# Altium schematic sheet MCU.SchDoc
size 594 x 420 mm; Address1: Address1; Address2: Address2; Address3: Address3; Address4: Address4; DocumentNumber: АБВГ.123456.001 Э3; SheetNumber: 2; Scale: 1:1; DocumentType: Схема электрическая принципиальная; FirstReferrence: АБВГ.123456.001; PageSetup: Record=PageOptions|CenterHorizontal=False|CenterVertical=False|PrintScale=0.95|XCorrection=0.00|YCorrection=0.00|PrintKind=1|BorderSize=5000000|LeftOffset=0|BottomOffset=0|Orientation=1|PaperLength=1000|PaperWidth=1000|Scale=100|PaperSource=15|PrintQuality=600|MediaType=1|DitherType=10|PaperKind=A4|PrintScaleMode=1
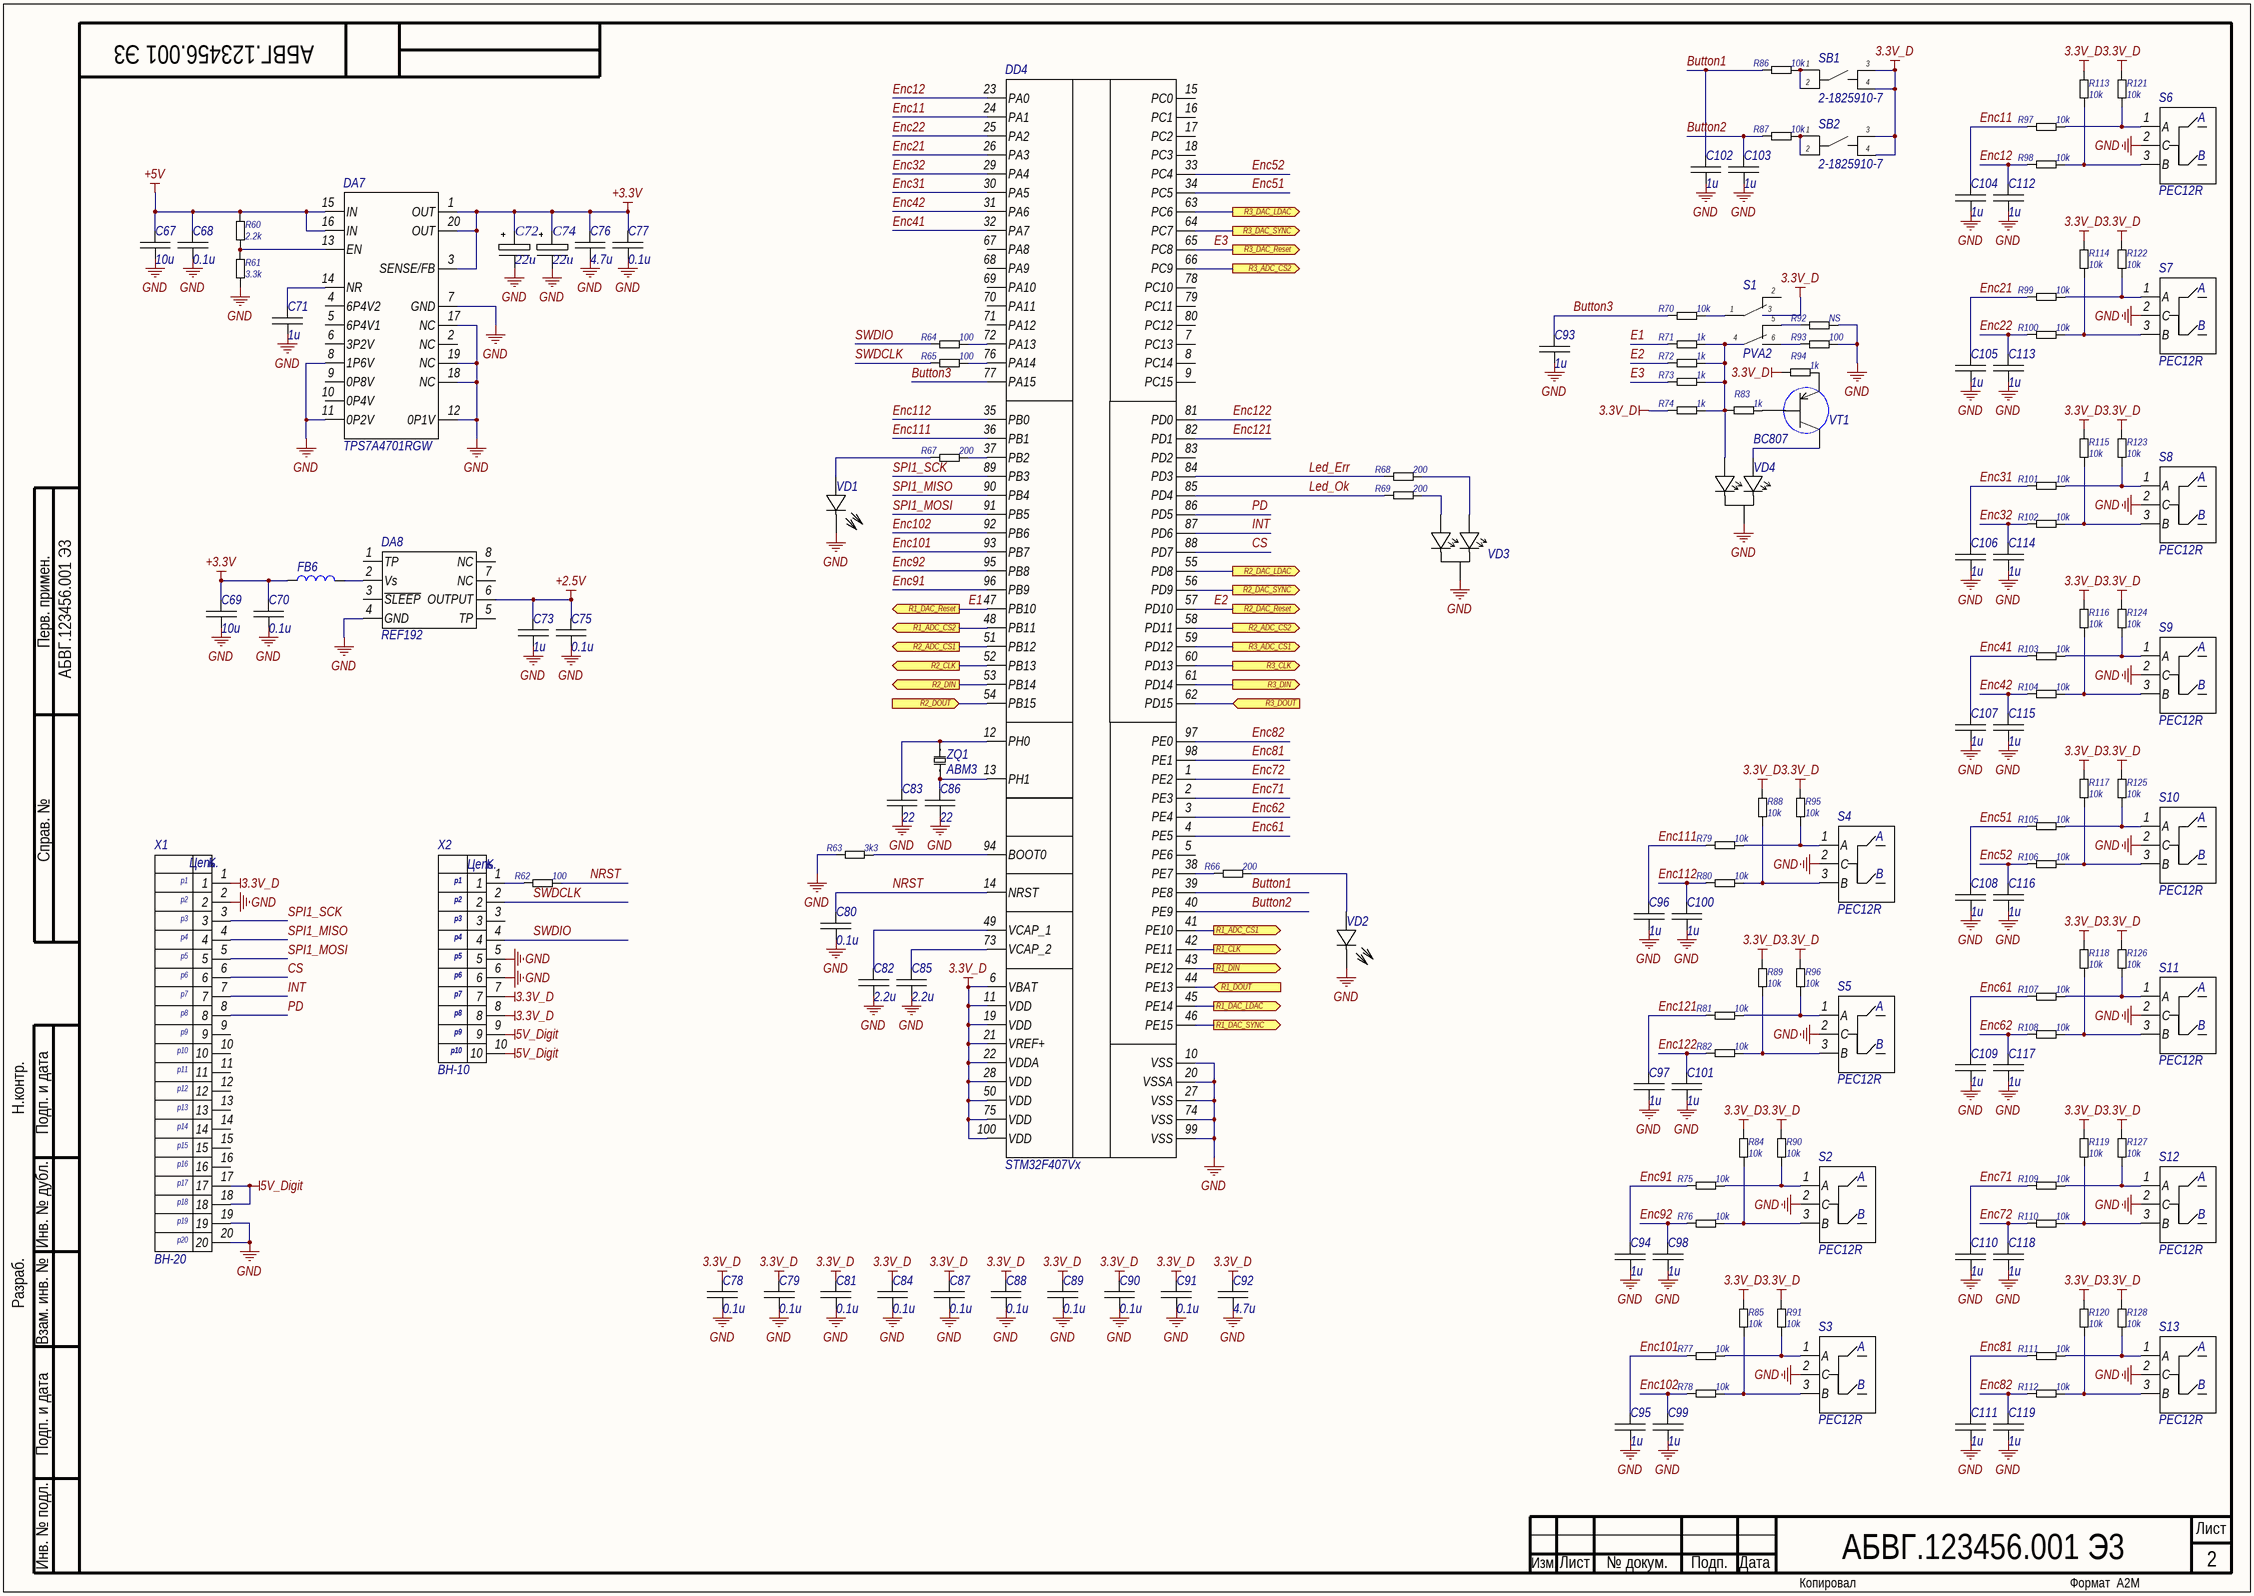
[diagram p0: MCU.SchDoc]

## Parts
C67  10u  [C1206]
C68  0.1u  [C0805]
C69  10u  [C1206]
C70  0.1u  [C0805]
C71  1u  [C0805]
C72  22u  [C0605]
C73  1u  [C0805]
C74  22u  [C0605]
C75  0.1u  [C0805]
C76  4.7u  [C0805]
C77  0.1u  [C0805]
C78  0.1u  [C0603]
C79  0.1u  [C0603]
C80  0.1u  [C0603]
C81  0.1u  [C0603]
C82  2.2u  [C0805]
C83  22  [C0603]
C84  0.1u  [C0603]
C85  2.2u  [C0805]
C86  22  [C0603]
C87  0.1u  [C0603]
C88  0.1u  [C0603]
C89  0.1u  [C0603]
C90  0.1u  [C0603]
C91  0.1u  [C0603]
C92  4.7u  [C0805]
C93  1u  [C0805]
C94  1u  [C0805]
C95  1u  [C0805]
C96  1u  [C0805]
C97  1u  [C0805]
C98  1u  [C0805]
C99  1u  [C0805]
C100  1u  [C0805]
C101  1u  [C0805]
C102  1u  [C0805]
C103  1u  [C0805]
C104  1u  [C0805]
C105  1u  [C0805]
C106  1u  [C0805]
C107  1u  [C0805]
C108  1u  [C0805]
C109  1u  [C0805]
C110  1u  [C0805]
C111  1u  [C0805]
C112  1u  [C0805]
C113  1u  [C0805]
C114  1u  [C0805]
C115  1u  [C0805]
C116  1u  [C0805]
C117  1u  [C0805]
C118  1u  [C0805]
C119  1u  [C0805]
DA7  TPS7A4701RGW  [QFN20 5x5]
DA8  REF192  [TSSOP-8_4mm]
DD4  STM32F407Vx  [LQFP100]
FB6  MH1608-601Y  [L0603]  (value not drawn)
R60  2.2k  [CR0805]
R61  3.3k  [CR0805]
R62  100  [CR0603]
R63  3k3  [CR0603]
R64  100  [CR0603]
R65  100  [CR0603]
R66  200  [CR0805]
R67  200  [CR0805]
R68  200  [CR0805]
R69  200  [CR0805]
R70  10k  [CR0805]
R71  1k  [CR0805]
R72  1k  [CR0805]
R73  1k  [CR0805]
R74  1k  [CR0805]
R75  10k  [CR0805]
R76  10k  [CR0805]
R77  10k  [CR0805]
R78  10k  [CR0805]
R79  10k  [CR0805]
R80  10k  [CR0805]
R81  10k  [CR0805]
R82  10k  [CR0805]
R83  1k  [CR0805]
R84  10k  [CR0805]
R85  10k  [CR0805]
R86  10k  [CR0805]
R87  10k  [CR0805]
R88  10k  [CR0805]
R89  10k  [CR0805]
R90  10k  [CR0805]
R91  10k  [CR0805]
R92  NS  [CR0805]
R93  100  [CR0805]
R94  1k  [CR0805]
R95  10k  [CR0805]
R96  10k  [CR0805]
R97  10k  [CR0805]
R98  10k  [CR0805]
R99  10k  [CR0805]
R100  10k  [CR0805]
R101  10k  [CR0805]
R102  10k  [CR0805]
R103  10k  [CR0805]
R104  10k  [CR0805]
R105  10k  [CR0805]
R106  10k  [CR0805]
R107  10k  [CR0805]
R108  10k  [CR0805]
R109  10k  [CR0805]
R110  10k  [CR0805]
R111  10k  [CR0805]
R112  10k  [CR0805]
R113  10k  [CR0805]
R114  10k  [CR0805]
R115  10k  [CR0805]
R116  10k  [CR0805]
R117  10k  [CR0805]
R118  10k  [CR0805]
R119  10k  [CR0805]
R120  10k  [CR0805]
R121  10k  [CR0805]
R122  10k  [CR0805]
R123  10k  [CR0805]
R124  10k  [CR0805]
R125  10k  [CR0805]
R126  10k  [CR0805]
R127  10k  [CR0805]
R128  10k  [CR0805]
S1  PVA2  [PVA2]
S2  PEC12R  [PEC12R]
S3  PEC12R  [PEC12R]
S4  PEC12R  [PEC12R]
S5  PEC12R  [PEC12R]
S6  PEC12R  [PEC12R]
S7  PEC12R  [PEC12R]
S8  PEC12R  [PEC12R]
S9  PEC12R  [PEC12R]
S10  PEC12R  [PEC12R]
S11  PEC12R  [PEC12R]
S12  PEC12R  [PEC12R]
S13  PEC12R  [PEC12R]
SB1  2-1825910-7  [Tactile_Button]
SB2  2-1825910-7  [Tactile_Button]
VD1  0805  [led 0805]  (value not drawn)
VD2  0805  [led 0805]  (value not drawn)
VD3  LED_BI  [LED_BI_5mm]  (value not drawn)
VD4  LED_BI  [LED_BI_5mm]  (value not drawn)
VT1  BC807  [SOT23]
X1  BH-20  [BH-20]
X2  BH-10  [BH-10]
ZQ1  ABM3  [ABM3]

## Ports
R1_ADC_CS1 (out), R1_ADC_CS2 (out), R1_CLK (out), R1_DAC_LDAC (out), R1_DAC_Reset (out), R1_DAC_SYNC (out), R1_DIN (out), R1_DOUT (in), R2_ADC_CS1 (out), R2_ADC_CS2 (out), R2_CLK (out), R2_DAC_LDAC (out), R2_DAC_Reset (out), R2_DAC_SYNC (out), R2_DIN (out), R2_DOUT (in), R3_ADC_CS1 (out), R3_ADC_CS2 (out), R3_CLK (out), R3_DAC_LDAC (out), R3_DAC_Reset (out), R3_DAC_SYNC (out), R3_DIN (out), R3_DOUT (in)

## Nets
3.3V_D: C78.1 C79.1 C81.1 C84.1 C87.1 C88.1 C89.1 C90.1 C91.1 C92.1 DD4.6(VBAT) DD4.11(VDD) DD4.19(VDD) DD4.21(VREF+) DD4.22(VDDA) DD4.28(VDD) DD4.50(VDD) DD4.75(VDD) DD4.100(VDD) R74.1 R84.2 R85.2 R88.2 R89.2 R90.2 R91.2 R94.1 R95.2 R96.2 R113.2 R114.2 R115.2 R116.2 R117.2 R118.2 R119.2 R120.2 R121.2 R122.2 R123.2 R124.2 R125.2 R126.2 R127.2 R128.2 S1.3 SB1.3 SB1.4 SB2.3 SB2.4 X1.1 X2.7 X2.8
5V_Digit: X1.17 X1.18 X2.9 X2.10
+2.5V: C73.1 C75.1 DA8.6(OUTPUT)
+3.3V: C69.1 C70.1 C72.1 C74.1 C76.1 C77.1 DA7.1(OUT) DA7.3(SENSE/FB) DA7.20(OUT) FB6.1
+5V: C67.1 C68.1 DA7.15(IN) DA7.16(IN) R60.2
GND: C67.2 C68.2 C69.2 C70.2 C71.2 C72.2 C73.2 C74.2 C75.2 C76.2 C77.2 C78.2 C79.2 C80.2 C81.2 C82.2 C83.2 C84.2 C85.2 C86.2 C87.2 C88.2 C89.2 C90.2 C91.2 C92.2 C93.2 C94.2 C95.2 C96.2 C97.2 C98.2 C99.2 C100.2 C101.2 C102.2 C103.2 C104.2 C105.2 C106.2 C107.2 C108.2 C109.2 C110.2 C111.2 C112.2 C113.2 C114.2 C115.2 C116.2 C117.2 C118.2 C119.2 DA7.7(GND) DA7.8(1P6V) DA7.11(0P2V) DA7.12(0P1V) DA7.17(NC) DA7.18(NC) DA7.19(NC) DA8.4(GND) DD4.10(VSS) DD4.20(VSSA) DD4.27(VSS) DD4.74(VSS) DD4.99(VSS) R61.1 R63.1 R92.2 R93.2 S2.2(C) S3.2(C) S4.2(C) S5.2(C) S6.2(C) S7.2(C) S8.2(C) S9.2(C) S10.2(C) S11.2(C) S12.2(C) S13.2(C) VD1.2 VD2.2 VD3.2 VD4.2 X1.2 X1.19 X1.20 X2.5 X2.6
Button1: C102.1 DD4.39(PE8) R86.1
Button2: C103.1 DD4.40(PE9) R87.1
Button3: C93.1 DD4.77(PA15) R70.1
CS: DD4.88(PD7) X1.6
E1: DD4.47(PB10) R71.1 ; port R1_DAC_Reset
E2: DD4.57(PD10) R72.1 ; port R2_DAC_Reset
E3: DD4.65(PC8) R73.1 ; port R3_DAC_Reset
Enc11: C104.1 DD4.24(PA1) R97.1
Enc12: C112.1 DD4.23(PA0) R98.1
Enc21: C105.1 DD4.26(PA3) R99.1
Enc22: C113.1 DD4.25(PA2) R100.1
Enc31: C106.1 DD4.30(PA5) R101.1
Enc32: C114.1 DD4.29(PA4) R102.1
Enc41: C107.1 DD4.32(PA7) R103.1
Enc42: C115.1 DD4.31(PA6) R104.1
Enc51: C108.1 DD4.34(PC5) R105.1
Enc52: C116.1 DD4.33(PC4) R106.1
Enc61: C109.1 DD4.4(PE5) R107.1
Enc62: C117.1 DD4.3(PE4) R108.1
Enc71: C110.1 DD4.2(PE3) R109.1
Enc72: C118.1 DD4.1(PE2) R110.1
Enc81: C111.1 DD4.98(PE1) R111.1
Enc82: C119.1 DD4.97(PE0) R112.1
Enc91: C94.1 DD4.96(PB9) R75.1
Enc92: C98.1 DD4.95(PB8) R76.1
Enc101: C95.1 DD4.93(PB7) R77.1
Enc102: C99.1 DD4.92(PB6) R78.1
Enc111: C96.1 DD4.36(PB1) R79.1
Enc112: C100.1 DD4.35(PB0) R80.1
Enc121: C97.1 DD4.82(PD1) R81.1
Enc122: C101.1 DD4.81(PD0) R82.1
INT: DD4.87(PD6) X1.7
Led_Err: DD4.84(PD3) R68.1
Led_Ok: DD4.85(PD4) R69.1
NRST: C80.1 DD4.14(NRST) R62.2
PD: DD4.86(PD5) X1.8
R1_ADC_CS1: DD4.41(PE10) ; port R1_ADC_CS1
R1_ADC_CS2: DD4.48(PB11) ; port R1_ADC_CS2
R1_CLK: DD4.42(PE11) ; port R1_CLK
R1_DAC_LDAC: DD4.45(PE14) ; port R1_DAC_LDAC
R1_DAC_SYNC: DD4.46(PE15) ; port R1_DAC_SYNC
R1_DIN: DD4.43(PE12) ; port R1_DIN
R1_DOUT: DD4.44(PE13) ; port R1_DOUT
R2_ADC_CS1: DD4.51(PB12) ; port R2_ADC_CS1
R2_ADC_CS2: DD4.58(PD11) ; port R2_ADC_CS2
R2_CLK: DD4.52(PB13) ; port R2_CLK
R2_DAC_LDAC: DD4.55(PD8) ; port R2_DAC_LDAC
R2_DAC_SYNC: DD4.56(PD9) ; port R2_DAC_SYNC
R2_DIN: DD4.53(PB14) ; port R2_DIN
R2_DOUT: DD4.54(PB15) ; port R2_DOUT
R3_ADC_CS1: DD4.59(PD12) ; port R3_ADC_CS1
R3_ADC_CS2: DD4.66(PC9) ; port R3_ADC_CS2
R3_CLK: DD4.60(PD13) ; port R3_CLK
R3_DAC_LDAC: DD4.63(PC6) ; port R3_DAC_LDAC
R3_DAC_SYNC: DD4.64(PC7) ; port R3_DAC_SYNC
R3_DIN: DD4.61(PD14) ; port R3_DIN
R3_DOUT: DD4.62(PD15) ; port R3_DOUT
SPI1_MISO: DD4.90(PB4) X1.4
SPI1_MOSI: DD4.91(PB5) X1.5
SPI1_SCK: DD4.89(PB3) X1.3
SWDCLK: R65.1 X2.2
SWDIO: R64.1 X2.4
NetC71_1: C71.1 DA7.14(NR)
NetC82_1: C82.1 DD4.49(VCAP_1)
NetC83_1: C83.1 DD4.12(PH0) ZQ1.2
NetC85_1: C85.1 DD4.73(VCAP_2)
NetC86_1: C86.1 DD4.13(PH1) ZQ1.1
NetDA7_13: DA7.13(EN) R60.1 R61.2
NetDA8_2: DA8.2(Vs) FB6.2
NetDD4_37: DD4.37(PB2) R67.1
NetDD4_38: DD4.38(PE7) R66.2
NetDD4_72: DD4.72(PA13) R64.2
NetDD4_76: DD4.76(PA14) R65.2
NetDD4_94: DD4.94(BOOT0) R63.2
NetR62_1: R62.1 X2.1
NetR66_1: R66.1 VD2.1
NetR67_2: R67.2 VD1.1
NetR68_2: R68.2 VD3.1
NetR69_2: R69.2 VD3.3
NetR70_2: R70.2 S1.1
NetR71_2: R71.2 R72.2 R73.2 R74.2 R83.1 S1.4 VD4.3
NetR75_2: R75.2 R90.1 S2.1(A)
NetR76_2: R76.2 R84.1 S2.3(B)
NetR77_2: R77.2 R91.1 S3.1(A)
NetR78_2: R78.2 R85.1 S3.3(B)
NetR79_2: R79.2 R95.1 S4.1(A)
NetR80_2: R80.2 R88.1 S4.3(B)
NetR81_2: R81.2 R96.1 S5.1(A)
NetR82_2: R82.2 R89.1 S5.3(B)
NetR83_2: R83.2 VT1.1
NetR86_2: R86.2 SB1.1 SB1.2
NetR87_2: R87.2 SB2.1 SB2.2
NetR92_1: R92.1 S1.5
NetR93_1: R93.1 S1.6
NetR94_2: R94.2 VT1.2
NetR97_2: R97.2 R121.1 S6.1(A)
NetR98_2: R98.2 R113.1 S6.3(B)
NetR99_2: R99.2 R122.1 S7.1(A)
NetR100_2: R100.2 R114.1 S7.3(B)
NetR101_2: R101.2 R123.1 S8.1(A)
NetR102_2: R102.2 R115.1 S8.3(B)
NetR103_2: R103.2 R124.1 S9.1(A)
NetR104_2: R104.2 R116.1 S9.3(B)
NetR105_2: R105.2 R125.1 S10.1(A)
NetR106_2: R106.2 R117.1 S10.3(B)
NetR107_2: R107.2 R126.1 S11.1(A)
NetR108_2: R108.2 R118.1 S11.3(B)
NetR109_2: R109.2 R127.1 S12.1(A)
NetR110_2: R110.2 R119.1 S12.3(B)
NetR111_2: R111.2 R128.1 S13.1(A)
NetR112_2: R112.2 R120.1 S13.3(B)
NetVD4_1: VD4.1 VT1.3

Not connected (* = marked no-connect by the designer): DA7 2(NC) 4(6P4V2) 5(6P4V1) 6(3P2V) 9(0P8V) 10(0P4V); DA8 1(TP) 3(~{SLEEP}) 5(TP) 7(NC) 8(NC); DD4 5(PE6) 7(PC13) 8(PC14) 9(PC15) 15(PC0) 16(PC1) 17(PC2) 18(PC3) 67(PA8) 68(PA9) 69(PA10) 70(PA11) 71(PA12) 78(PC10) 79(PC11) 80(PC12) 83(PD2); S1 2; X1 9 10 11 12 13 14 15 16; X2 3

## Notes on the sheet
- Перв. примен.
- Справ. №
- Н.контр.
- Подп. и дата
- Инв. № дубл.
- Разраб.
- Взам. инв. №
- Инв. № подл.
- Лист
- Изм.
- № докум.
- Подп.
- Дата
- Копировал
- Формат  A2М
- (in symbol BH-10) Цепь; K.; p1; p2; p3; p4; p5; p6; p7; p8; p9; p10
- (in symbol BH-20) Цепь; K.; p1; p2; p3; p4; p5; p6; p7; p8; p9; p10; p11; p12; p13; p14; p15; p16; p17; p18; p19; p20

## Library data of the parts
C67-C71 C73 C75-C119 = Capacitor Ceramic SMD
C72 C74 = Capacitor Electrolytic
FB6 = Ferrite Bead
R60-R128 = Resistor SMD
S1 = Switch - Push-Push
S2-S13 = Encoder incremental
SB1 SB2 = Tactile Button
VD1 VD2 = led 0805
ZQ1 = Quartz ABM3